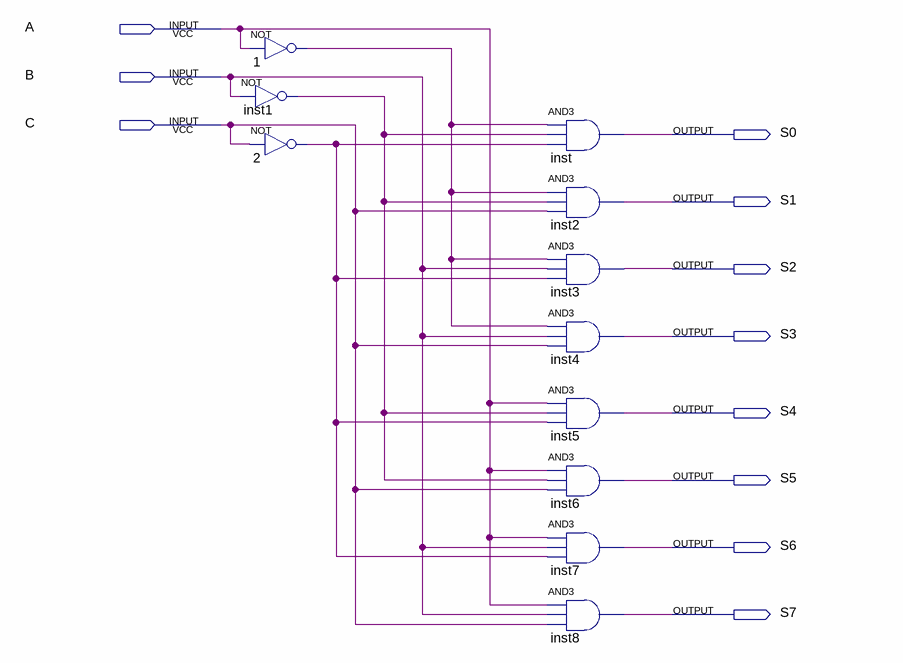
[diagram p0: schematic sheet]
// Quartus schematic decoder3_8.bdf as structural Verilog: 11 symbols, 11 pins
module decoder3_8 (
  input  A,
  input  B,
  input  C,
  output S0,
  output S1,
  output S2,
  output S3,
  output S4,
  output S5,
  output S6,
  output S7
);

  wire inst1_out, n1_out, n2_out;

  not u_1 (n1_out, A);
  not inst1 (inst1_out, B);
  not u_2 (n2_out, C);
  and inst (S0, n1_out, inst1_out, n2_out);
  and inst2 (S1, n1_out, inst1_out, C);
  and inst3 (S2, n1_out, B, n2_out);
  and inst4 (S3, n1_out, B, C);
  and inst5 (S4, A, inst1_out, n2_out);
  and inst6 (S5, A, inst1_out, C);
  and inst7 (S6, A, B, n2_out);
  and inst8 (S7, A, B, C);
endmodule
